# EAGLE schematic nano-esp-stm-breakout (EAGLE 9.6.2)

## Sheet 1 of 2
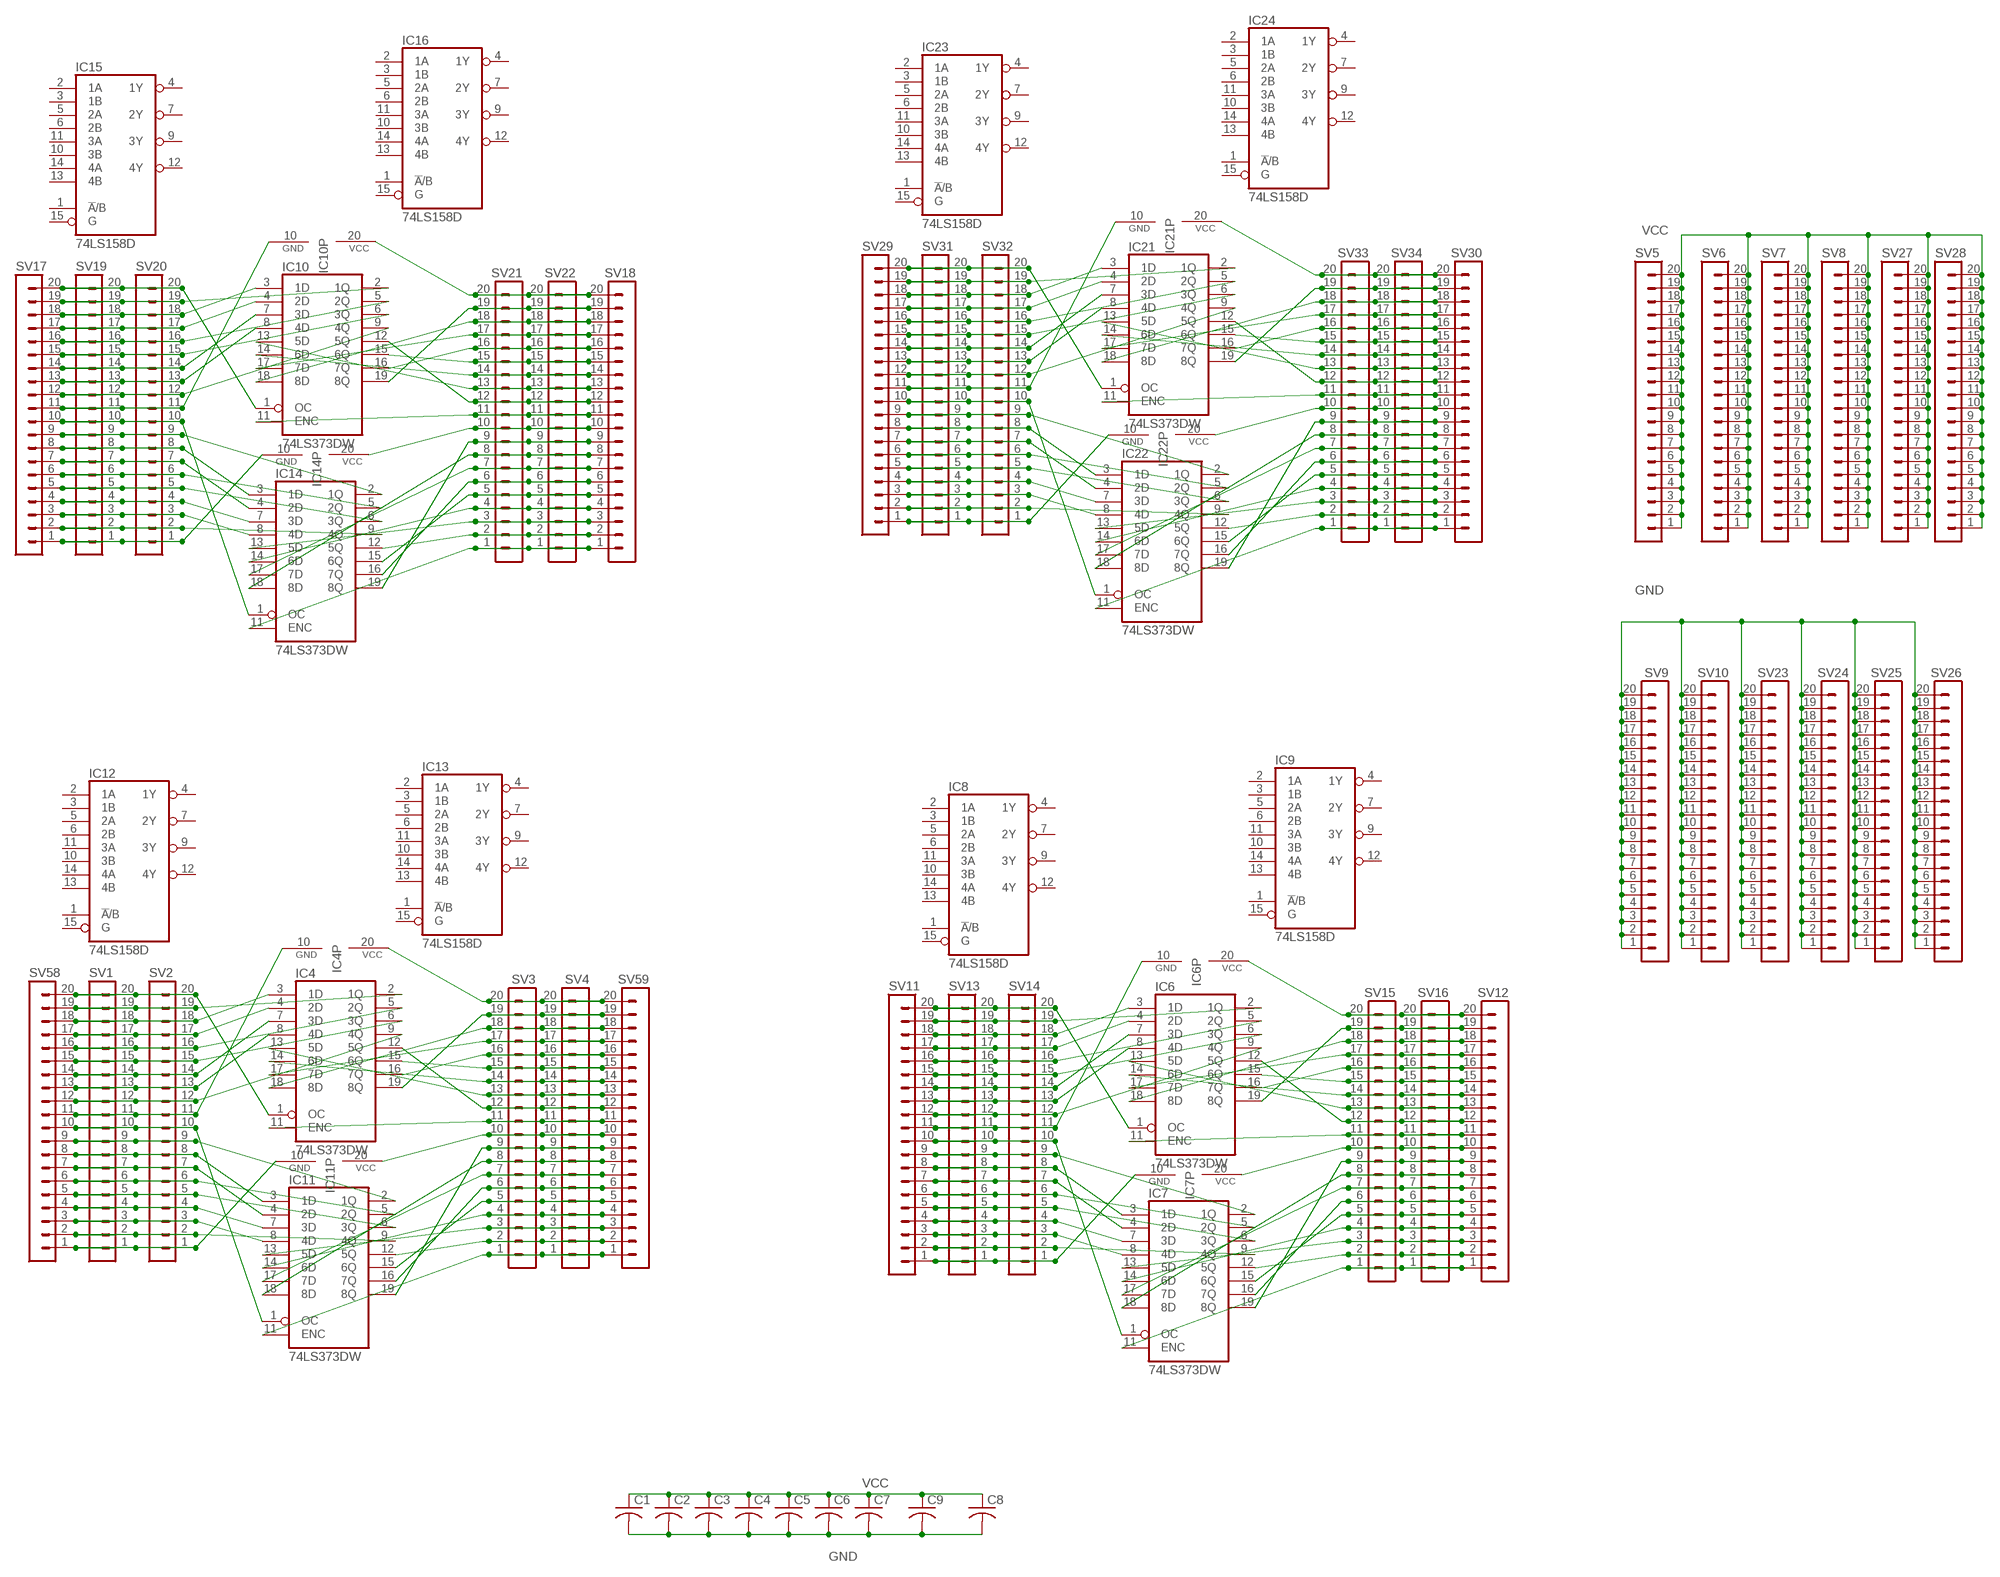
[diagram p0: schematic, sheet 1]

### Parts
C1  C-USC0805  [C0805]
C2  C-USC0805  [C0805]
C3  C-USC0805  [C0805]
C4  C-USC0805  [C0805]
C5  C-USC0805  [C0805]
C6  C-USC0805  [C0805]
C7  C-USC0805  [C0805]
C8  C-USC0805  [C0805]
C9  C-USC0805  [C0805]
IC4  74LS373DW  [SO20W]
IC6  74LS373DW  [SO20W]
IC7  74LS373DW  [SO20W]
IC8  74LS158D  [SO16]
IC9  74LS158D  [SO16]
IC10  74LS373DW  [SO20W]
IC11  74LS373DW  [SO20W]
IC12  74LS158D  [SO16]
IC13  74LS158D  [SO16]
IC14  74LS373DW  [SO20W]
IC15  74LS158D  [SO16]
IC16  74LS158D  [SO16]
IC21  74LS373DW  [SO20W]
IC22  74LS373DW  [SO20W]
IC23  74LS158D  [SO16]
IC24  74LS158D  [SO16]
SV1  MA20-1  [MA20-1]
SV2  MA20-1  [MA20-1]
SV3  MA20-1  [MA20-1]
SV4  MA20-1  [MA20-1]
SV5  MA20-1  [MA20-1]
SV6  MA20-1  [MA20-1]
SV7  MA20-1  [MA20-1]
SV8  MA20-1  [MA20-1]
SV9  MA20-1  [MA20-1]
SV10  MA20-1  [MA20-1]
SV11  MA20-1  [MA20-1]
SV12  MA20-1  [MA20-1]
SV13  MA20-1  [MA20-1]
SV14  MA20-1  [MA20-1]
SV15  MA20-1  [MA20-1]
SV16  MA20-1  [MA20-1]
SV17  MA20-1  [MA20-1]
SV18  MA20-1  [MA20-1]
SV19  MA20-1  [MA20-1]
SV20  MA20-1  [MA20-1]
SV21  MA20-1  [MA20-1]
SV22  MA20-1  [MA20-1]
SV23  MA20-1  [MA20-1]
SV24  MA20-1  [MA20-1]
SV25  MA20-1  [MA20-1]
SV26  MA20-1  [MA20-1]
SV27  MA20-1  [MA20-1]
SV28  MA20-1  [MA20-1]
SV29  MA20-1  [MA20-1]
SV30  MA20-1  [MA20-1]
SV31  MA20-1  [MA20-1]
SV32  MA20-1  [MA20-1]
SV33  MA20-1  [MA20-1]
SV34  MA20-1  [MA20-1]
SV58  MA20-1  [MA20-1]
SV59  MA20-1  [MA20-1]

### Nets
GND: C1.2 C2.2 C3.2 C4.2 C5.2 C6.2 C7.2 C8.2 C9.2 SV9.1 SV9.2 SV9.3 SV9.4 SV9.5 SV9.6 SV9.7 SV9.8 SV9.9 SV9.10 SV9.11 SV9.12 SV9.13 SV9.14 SV9.15 SV9.16 SV9.17 SV9.18 SV9.19 SV9.20 SV10.1 SV10.2 SV10.3 SV10.4 SV10.5 SV10.6 SV10.7 SV10.8 SV10.9 SV10.10 SV10.11 SV10.12 SV10.13 SV10.14 SV10.15 SV10.16 SV10.17 SV10.18 SV10.19 SV10.20 SV23.1 SV23.2 SV23.3 SV23.4 SV23.5 SV23.6 SV23.7 SV23.8 SV23.9 SV23.10 SV23.11 SV23.12 SV23.13 SV23.14 SV23.15 SV23.16 SV23.17 SV23.18 SV23.19 SV23.20 SV24.1 SV24.2 SV24.3 SV24.4 SV24.5 SV24.6 SV24.7 SV24.8 SV24.9 SV24.10 SV24.11 SV24.12 SV24.13 SV24.14 SV24.15 SV24.16 SV24.17 SV24.18 SV24.19 SV24.20 SV25.1 SV25.2 SV25.3 SV25.4 SV25.5 SV25.6 SV25.7 SV25.8 SV25.9 SV25.10 SV25.11 SV25.12 SV25.13 SV25.14 SV25.15 SV25.16 SV25.17 SV25.18 SV25.19 SV25.20 SV26.1 SV26.2 SV26.3 SV26.4 SV26.5 SV26.6 SV26.7 SV26.8 SV26.9 SV26.10 SV26.11 SV26.12 SV26.13 SV26.14 SV26.15 SV26.16 SV26.17 SV26.18 SV26.19 SV26.20 ; also sheet 2
N$41: IC7.9(4Q) SV11.2 SV13.2 SV14.2
N$42: IC7.7(3D) SV11.4 SV13.4 SV14.4
N$43: IC7.6(3Q) SV11.5 SV13.5 SV14.5
N$44: IC7.5(2Q) SV11.6 SV13.6 SV14.6
N$45: IC7.3(1D) SV11.8 SV13.8 SV14.8
N$46: IC7.2(1Q) SV11.9 SV13.9 SV14.9
N$47: IC7.1(OC) SV11.10 SV13.10 SV14.10
N$48: IC6.10(GND) SV11.11 SV13.11 SV14.11
N$49: IC6.9(4Q) SV11.12 SV13.12 SV14.12
N$50: IC6.7(3D) SV11.14 SV13.14 SV14.14
N$51: IC6.6(3Q) SV11.15 SV13.15 SV14.15
N$52: IC6.5(2Q) SV11.16 SV13.16 SV14.16
N$53: IC6.3(1D) SV11.18 SV13.18 SV14.18
N$54: IC6.2(1Q) SV11.19 SV13.19 SV14.19
N$55: IC6.1(OC) SV11.20 SV13.20 SV14.20
N$56: IC7.11(ENC) SV12.1 SV15.1 SV16.1
N$57: IC7.12(5Q) SV12.2 SV15.2 SV16.2
N$58: IC7.13(5D) SV12.3 SV15.3 SV16.3
N$59: IC7.14(6D) SV12.4 SV15.4 SV16.4
N$60: IC7.15(6Q) SV12.5 SV15.5 SV16.5
N$61: IC7.16(7Q) SV12.6 SV15.6 SV16.6
N$62: IC7.17(7D) SV12.7 SV15.7 SV16.7
N$63: IC7.18(8D) SV12.8 SV15.8 SV16.8
N$64: IC7.19(8Q) SV12.9 SV15.9 SV16.9
N$65: IC7.20(VCC) SV12.10 SV15.10 SV16.10
N$66: IC6.11(ENC) SV12.11 SV15.11 SV16.11
N$67: IC6.12(5Q) SV12.12 SV15.12 SV16.12
N$68: IC6.13(5D) SV12.13 SV15.13 SV16.13
N$69: IC6.14(6D) SV12.14 SV15.14 SV16.14
N$70: IC6.15(6Q) SV12.15 SV15.15 SV16.15
N$71: IC6.16(7Q) SV12.16 SV15.16 SV16.16
N$72: IC6.17(7D) SV12.17 SV15.17 SV16.17
N$73: IC6.18(8D) SV12.18 SV15.18 SV16.18
N$74: IC6.19(8Q) SV12.19 SV15.19 SV16.19
N$75: IC7.10(GND) SV11.1 SV13.1 SV14.1
N$76: IC7.8(4D) SV11.3 SV13.3 SV14.3
N$77: IC7.4(2D) SV11.7 SV13.7 SV14.7
N$78: IC6.8(4D) SV11.13 SV13.13 SV14.13
N$79: IC6.4(2D) SV11.17 SV13.17 SV14.17
N$80: IC6.20(VCC) SV12.20 SV15.20 SV16.20
N$81: IC14.9(4Q) SV17.2 SV19.2 SV20.2
N$82: IC14.7(3D) SV17.4 SV19.4 SV20.4
N$83: IC14.6(3Q) SV17.5 SV19.5 SV20.5
N$84: IC14.5(2Q) SV17.6 SV19.6 SV20.6
N$85: IC14.3(1D) SV17.8 SV19.8 SV20.8
N$86: IC14.2(1Q) SV17.9 SV19.9 SV20.9
N$87: IC14.1(OC) SV17.10 SV19.10 SV20.10
N$88: IC10.10(GND) SV17.11 SV19.11 SV20.11
N$89: IC10.9(4Q) SV17.12 SV19.12 SV20.12
N$90: IC10.7(3D) SV17.14 SV19.14 SV20.14
N$91: IC10.6(3Q) SV17.15 SV19.15 SV20.15
N$92: IC10.5(2Q) SV17.16 SV19.16 SV20.16
N$93: IC10.3(1D) SV17.18 SV19.18 SV20.18
N$94: IC10.2(1Q) SV17.19 SV19.19 SV20.19
N$95: IC10.1(OC) SV17.20 SV19.20 SV20.20
N$96: IC14.11(ENC) SV18.1 SV21.1 SV22.1
N$97: IC14.12(5Q) SV18.2 SV21.2 SV22.2
N$98: IC14.13(5D) SV18.3 SV21.3 SV22.3
N$99: IC14.14(6D) SV18.4 SV21.4 SV22.4
N$100: IC14.15(6Q) SV18.5 SV21.5 SV22.5
N$101: IC14.16(7Q) SV18.6 SV21.6 SV22.6
N$102: IC14.17(7D) SV18.7 SV21.7 SV22.7
N$103: IC14.18(8D) SV18.8 SV21.8 SV22.8
N$104: IC14.19(8Q) SV18.9 SV21.9 SV22.9
N$105: IC14.20(VCC) SV18.10 SV21.10 SV22.10
N$106: IC10.11(ENC) SV18.11 SV21.11 SV22.11
N$107: IC10.12(5Q) SV18.12 SV21.12 SV22.12
N$108: IC10.13(5D) SV18.13 SV21.13 SV22.13
N$109: IC10.14(6D) SV18.14 SV21.14 SV22.14
N$110: IC10.15(6Q) SV18.15 SV21.15 SV22.15
N$111: IC10.16(7Q) SV18.16 SV21.16 SV22.16
N$112: IC10.17(7D) SV18.17 SV21.17 SV22.17
N$113: IC10.18(8D) SV18.18 SV21.18 SV22.18
N$114: IC10.19(8Q) SV18.19 SV21.19 SV22.19
N$115: IC14.10(GND) SV17.1 SV19.1 SV20.1
N$116: IC14.8(4D) SV17.3 SV19.3 SV20.3
N$117: IC14.4(2D) SV17.7 SV19.7 SV20.7
N$118: IC10.8(4D) SV17.13 SV19.13 SV20.13
N$119: IC10.4(2D) SV17.17 SV19.17 SV20.17
N$120: IC10.20(VCC) SV18.20 SV21.20 SV22.20
N$161: IC22.9(4Q) SV29.2 SV31.2 SV32.2
N$162: IC22.7(3D) SV29.4 SV31.4 SV32.4
N$163: IC22.6(3Q) SV29.5 SV31.5 SV32.5
N$164: IC22.5(2Q) SV29.6 SV31.6 SV32.6
N$165: IC22.3(1D) SV29.8 SV31.8 SV32.8
N$166: IC22.2(1Q) SV29.9 SV31.9 SV32.9
N$167: IC22.1(OC) SV29.10 SV31.10 SV32.10
N$168: IC21.10(GND) SV29.11 SV31.11 SV32.11
N$169: IC21.9(4Q) SV29.12 SV31.12 SV32.12
N$170: IC21.7(3D) SV29.14 SV31.14 SV32.14
N$171: IC21.6(3Q) SV29.15 SV31.15 SV32.15
N$172: IC21.5(2Q) SV29.16 SV31.16 SV32.16
N$173: IC21.3(1D) SV29.18 SV31.18 SV32.18
N$174: IC21.2(1Q) SV29.19 SV31.19 SV32.19
N$175: IC21.1(OC) SV29.20 SV31.20 SV32.20
N$176: IC22.11(ENC) SV30.1 SV33.1 SV34.1
N$177: IC22.12(5Q) SV30.2 SV33.2 SV34.2
N$178: IC22.13(5D) SV30.3 SV33.3 SV34.3
N$179: IC22.14(6D) SV30.4 SV33.4 SV34.4
N$180: IC22.15(6Q) SV30.5 SV33.5 SV34.5
N$181: IC22.16(7Q) SV30.6 SV33.6 SV34.6
N$182: IC22.17(7D) SV30.7 SV33.7 SV34.7
N$183: IC22.18(8D) SV30.8 SV33.8 SV34.8
N$184: IC22.19(8Q) SV30.9 SV33.9 SV34.9
N$185: IC22.20(VCC) SV30.10 SV33.10 SV34.10
N$186: IC21.11(ENC) SV30.11 SV33.11 SV34.11
N$187: IC21.12(5Q) SV30.12 SV33.12 SV34.12
N$188: IC21.13(5D) SV30.13 SV33.13 SV34.13
N$189: IC21.14(6D) SV30.14 SV33.14 SV34.14
N$190: IC21.15(6Q) SV30.15 SV33.15 SV34.15
N$191: IC21.16(7Q) SV30.16 SV33.16 SV34.16
N$192: IC21.17(7D) SV30.17 SV33.17 SV34.17
N$193: IC21.18(8D) SV30.18 SV33.18 SV34.18
N$194: IC21.19(8Q) SV30.19 SV33.19 SV34.19
N$195: IC22.10(GND) SV29.1 SV31.1 SV32.1
N$196: IC22.8(4D) SV29.3 SV31.3 SV32.3
N$197: IC22.4(2D) SV29.7 SV31.7 SV32.7
N$198: IC21.8(4D) SV29.13 SV31.13 SV32.13
N$199: IC21.4(2D) SV29.17 SV31.17 SV32.17
N$200: IC21.20(VCC) SV30.20 SV33.20 SV34.20
N$239: IC11.9(4Q) SV1.2 SV2.2 SV58.2
N$241: IC11.7(3D) SV1.4 SV2.4 SV58.4
N$242: IC11.6(3Q) SV1.5 SV2.5 SV58.5
N$243: IC11.5(2Q) SV1.6 SV2.6 SV58.6
N$245: IC11.3(1D) SV1.8 SV2.8 SV58.8
N$246: IC11.2(1Q) SV1.9 SV2.9 SV58.9
N$247: IC11.1(OC) SV1.10 SV2.10 SV58.10
N$248: IC4.10(GND) SV1.11 SV2.11 SV58.11
N$249: IC4.9(4Q) SV1.12 SV2.12 SV58.12
N$251: IC4.7(3D) SV1.14 SV2.14 SV58.14
N$252: IC4.6(3Q) SV1.15 SV2.15 SV58.15
N$253: IC4.5(2Q) SV1.16 SV2.16 SV58.16
N$255: IC4.3(1D) SV1.18 SV2.18 SV58.18
N$256: IC4.2(1Q) SV1.19 SV2.19 SV58.19
N$257: IC4.1(OC) SV1.20 SV2.20 SV58.20
N$258: IC11.11(ENC) SV3.1 SV4.1 SV59.1
N$259: IC11.12(5Q) SV3.2 SV4.2 SV59.2
N$260: IC11.13(5D) SV3.3 SV4.3 SV59.3
N$261: IC11.14(6D) SV3.4 SV4.4 SV59.4
N$262: IC11.15(6Q) SV3.5 SV4.5 SV59.5
N$263: IC11.16(7Q) SV3.6 SV4.6 SV59.6
N$264: IC11.17(7D) SV3.7 SV4.7 SV59.7
N$265: IC11.18(8D) SV3.8 SV4.8 SV59.8
N$266: IC11.19(8Q) SV3.9 SV4.9 SV59.9
N$267: IC11.20(VCC) SV3.10 SV4.10 SV59.10
N$268: IC4.11(ENC) SV3.11 SV4.11 SV59.11
N$269: IC4.12(5Q) SV3.12 SV4.12 SV59.12
N$270: IC4.13(5D) SV3.13 SV4.13 SV59.13
N$271: IC4.14(6D) SV3.14 SV4.14 SV59.14
N$272: IC4.15(6Q) SV3.15 SV4.15 SV59.15
N$273: IC4.16(7Q) SV3.16 SV4.16 SV59.16
N$274: IC4.17(7D) SV3.17 SV4.17 SV59.17
N$275: IC4.18(8D) SV3.18 SV4.18 SV59.18
N$276: IC4.19(8Q) SV3.19 SV4.19 SV59.19
N$278: IC11.10(GND) SV1.1 SV2.1 SV58.1
N$279: IC11.8(4D) SV1.3 SV2.3 SV58.3
N$281: IC11.4(2D) SV1.7 SV2.7 SV58.7
N$284: IC4.8(4D) SV1.13 SV2.13 SV58.13
N$286: IC4.4(2D) SV1.17 SV2.17 SV58.17
N$319: IC4.20(VCC) SV3.20 SV4.20 SV59.20
VCC: C1.1 C2.1 C3.1 C4.1 C5.1 C6.1 C7.1 C8.1 C9.1 SV5.1 SV5.2 SV5.3 SV5.4 SV5.5 SV5.6 SV5.7 SV5.8 SV5.9 SV5.10 SV5.11 SV5.12 SV5.13 SV5.14 SV5.15 SV5.16 SV5.17 SV5.18 SV5.19 SV5.20 SV6.1 SV6.2 SV6.3 SV6.4 SV6.5 SV6.6 SV6.7 SV6.8 SV6.9 SV6.10 SV6.11 SV6.12 SV6.13 SV6.14 SV6.15 SV6.16 SV6.17 SV6.18 SV6.19 SV6.20 SV7.1 SV7.2 SV7.3 SV7.4 SV7.5 SV7.6 SV7.7 SV7.8 SV7.9 SV7.10 SV7.11 SV7.12 SV7.13 SV7.14 SV7.15 SV7.16 SV7.17 SV7.18 SV7.19 SV7.20 SV8.1 SV8.2 SV8.3 SV8.4 SV8.5 SV8.6 SV8.7 SV8.8 SV8.9 SV8.10 SV8.11 SV8.12 SV8.13 SV8.14 SV8.15 SV8.16 SV8.17 SV8.18 SV8.19 SV8.20 SV27.1 SV27.2 SV27.3 SV27.4 SV27.5 SV27.6 SV27.7 SV27.8 SV27.9 SV27.10 SV27.11 SV27.12 SV27.13 SV27.14 SV27.15 SV27.16 SV27.17 SV27.18 SV27.19 SV27.20 SV28.1 SV28.2 SV28.3 SV28.4 SV28.5 SV28.6 SV28.7 SV28.8 SV28.9 SV28.10 SV28.11 SV28.12 SV28.13 SV28.14 SV28.15 SV28.16 SV28.17 SV28.18 SV28.19 SV28.20 ; also sheet 2
Unconnected: IC8.1(!A!/B) IC8.2(1A) IC8.3(1B) IC8.4(1Y) IC8.5(2A) IC8.6(2B) IC8.7(2Y) IC8.9(3Y) IC8.10(3B) IC8.11(3A) IC8.12(4Y) IC8.13(4B) IC8.14(4A) IC8.15(G) IC9.1(!A!/B) IC9.2(1A) IC9.3(1B) IC9.4(1Y) IC9.5(2A) IC9.6(2B) IC9.7(2Y) IC9.9(3Y) IC9.10(3B) IC9.11(3A) IC9.12(4Y) IC9.13(4B) IC9.14(4A) IC9.15(G) IC12.1(!A!/B) IC12.2(1A) IC12.3(1B) IC12.4(1Y) IC12.5(2A) IC12.6(2B) IC12.7(2Y) IC12.9(3Y) IC12.10(3B) IC12.11(3A) IC12.12(4Y) IC12.13(4B) IC12.14(4A) IC12.15(G) IC13.1(!A!/B) IC13.2(1A) IC13.3(1B) IC13.4(1Y) IC13.5(2A) IC13.6(2B) IC13.7(2Y) IC13.9(3Y) IC13.10(3B) IC13.11(3A) IC13.12(4Y) IC13.13(4B) IC13.14(4A) IC13.15(G) IC15.1(!A!/B) IC15.2(1A) IC15.3(1B) IC15.4(1Y) IC15.5(2A) IC15.6(2B) IC15.7(2Y) IC15.9(3Y) IC15.10(3B) IC15.11(3A) IC15.12(4Y) IC15.13(4B) IC15.14(4A) IC15.15(G) IC16.1(!A!/B) IC16.2(1A) IC16.3(1B) IC16.4(1Y) IC16.5(2A) IC16.6(2B) IC16.7(2Y) IC16.9(3Y) IC16.10(3B) IC16.11(3A) IC16.12(4Y) IC16.13(4B) IC16.14(4A) IC16.15(G) IC23.1(!A!/B) IC23.2(1A) IC23.3(1B) IC23.4(1Y) IC23.5(2A) IC23.6(2B) IC23.7(2Y) IC23.9(3Y) IC23.10(3B) IC23.11(3A) IC23.12(4Y) IC23.13(4B) IC23.14(4A) IC23.15(G) IC24.1(!A!/B) IC24.2(1A) IC24.3(1B) IC24.4(1Y) IC24.5(2A) IC24.6(2B) IC24.7(2Y) IC24.9(3Y) IC24.10(3B) IC24.11(3A) IC24.12(4Y) IC24.13(4B) IC24.14(4A) IC24.15(G)

## Sheet 2 of 2
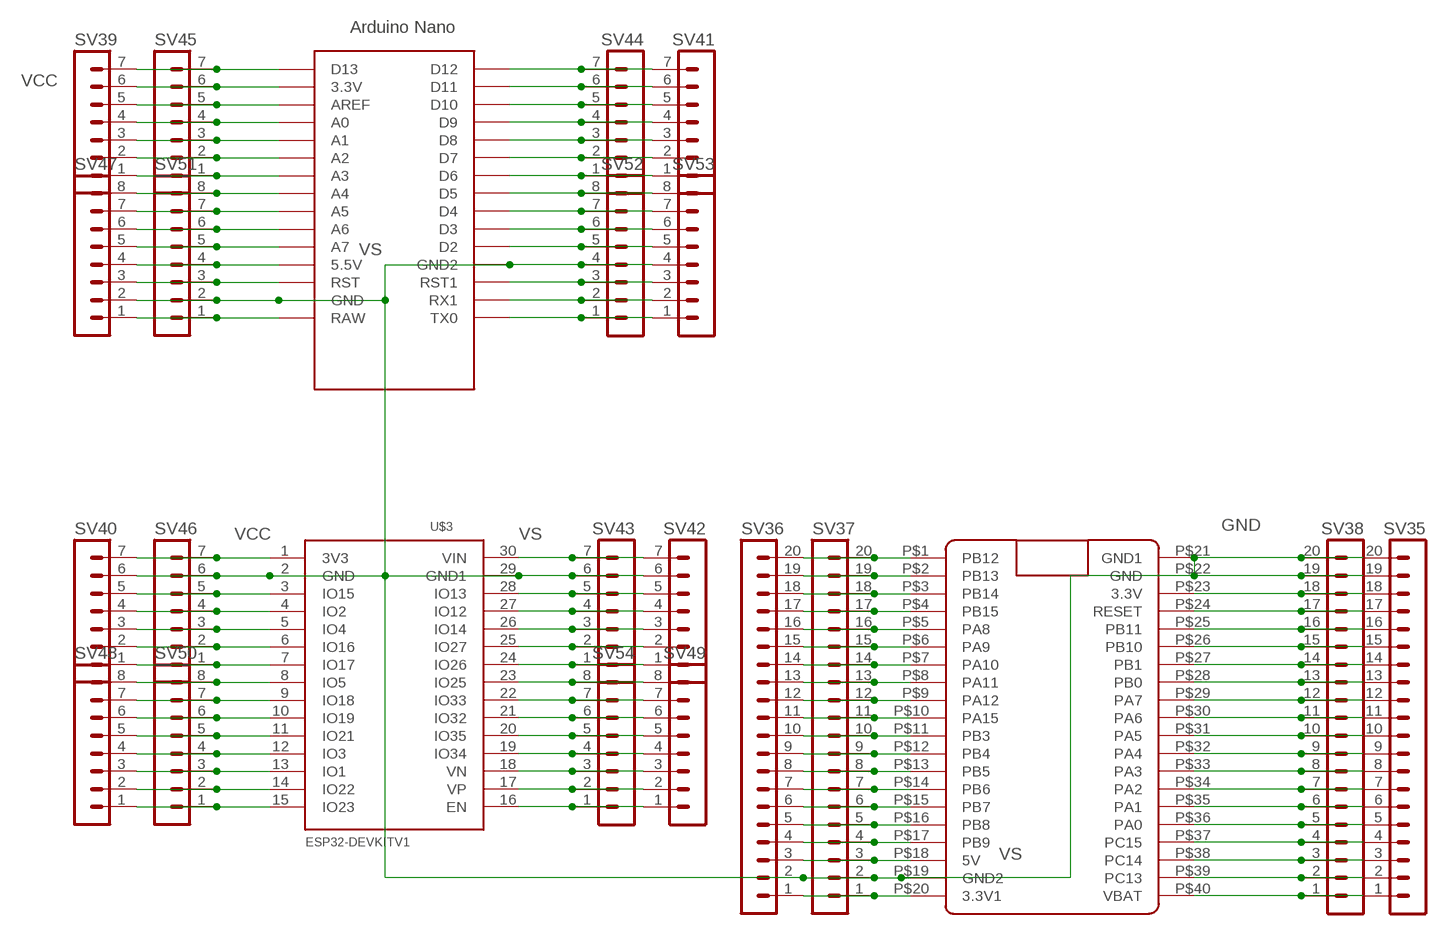
[diagram p1: schematic, sheet 2]

### Parts
SV35  MA20-1  [MA20-1]
SV36  MA20-1  [MA20-1]
SV37  MA20-1  [MA20-1]
SV38  MA20-1  [MA20-1]
SV39  MA07-1  [MA07-1]
SV40  MA07-1  [MA07-1]
SV41  MA07-1  [MA07-1]
SV42  MA07-1  [MA07-1]
SV43  MA07-1  [MA07-1]
SV44  MA07-1  [MA07-1]
SV45  MA07-1  [MA07-1]
SV46  MA07-1  [MA07-1]
SV47  MA08-1  [MA08-1]
SV48  MA08-1  [MA08-1]
SV49  MA08-1  [MA08-1]
SV50  MA08-1  [MA08-1]
SV51  MA08-1  [MA08-1]
SV52  MA08-1  [MA08-1]
SV53  MA08-1  [MA08-1]
SV54  MA08-1  [MA08-1]
U$1  NANO  [NANO]
U$2  BLUE_PILL  [BLUE_PILL]
U$3  ESP32DEVKITV1  [ESP32-DEVKITV1]

### Nets
GND: SV35.19 SV35.20 SV36.2 SV37.2 SV38.19 SV38.20 SV40.6 SV42.6 SV43.6 SV46.6 SV47.2 SV51.2 SV52.4 SV53.4 U$1.GND U$1.GND1(GND2) U$2.P$19(GND2) U$2.P$21(GND1) U$2.P$22(GND) U$3.2(GND) U$3.29(GND1) ; also sheet 1
N$1: SV39.1 SV45.1 U$1.A3
N$2: SV39.2 SV45.2 U$1.A2
N$3: SV35.18 SV38.18 U$2.P$23(3.3V)
N$4: SV35.17 SV38.17 U$2.P$24(RESET)
N$5: SV35.16 SV38.16 U$2.P$25(PB11)
N$6: SV35.15 SV38.15 U$2.P$26(PB10)
N$7: SV35.14 SV38.14 U$2.P$27(PB1)
N$8: SV35.13 SV38.13 U$2.P$28(PB0)
N$9: SV35.12 SV38.12 U$2.P$29(PA7)
N$10: SV35.11 SV38.11 U$2.P$30(PA6)
N$11: SV35.10 SV38.10 U$2.P$31(PA5)
N$12: SV35.9 SV38.9 U$2.P$32(PA4)
N$13: SV35.8 SV38.8 U$2.P$33(PA3)
N$14: SV35.7 SV38.7 U$2.P$34(PA2)
N$15: SV35.6 SV38.6 U$2.P$35(PA1)
N$16: SV35.5 SV38.5 U$2.P$36(PA0)
N$17: SV35.4 SV38.4 U$2.P$37(PC15)
N$18: SV35.3 SV38.3 U$2.P$38(PC14)
N$19: SV35.2 SV38.2 U$2.P$39(PC13)
N$20: SV35.1 SV38.1 U$2.P$40(VBAT)
N$21: SV36.1 SV37.1 U$2.P$20(3.3V1)
N$22: SV39.3 SV45.3 U$1.A1
N$24: SV36.4 SV37.4 U$2.P$17(PB9)
N$25: SV36.5 SV37.5 U$2.P$16(PB8)
N$26: SV36.6 SV37.6 U$2.P$15(PB7)
N$27: SV36.7 SV37.7 U$2.P$14(PB6)
N$28: SV36.8 SV37.8 U$2.P$13(PB5)
N$29: SV36.9 SV37.9 U$2.P$12(PB4)
N$30: SV36.10 SV37.10 U$2.P$11(PB3)
N$31: SV36.11 SV37.11 U$2.P$10(PA15)
N$32: SV36.12 SV37.12 U$2.P$9(PA12)
N$33: SV36.13 SV37.13 U$2.P$8(PA11)
N$34: SV36.14 SV37.14 U$2.P$7(PA10)
N$35: SV36.15 SV37.15 U$2.P$6(PA9)
N$36: SV36.16 SV37.16 U$2.P$5(PA8)
N$37: SV36.17 SV37.17 U$2.P$4(PB15)
N$38: SV36.18 SV37.18 U$2.P$3(PB14)
N$39: SV36.19 SV37.19 U$2.P$2(PB13)
N$40: SV36.20 SV37.20 U$2.P$1(PB12)
N$121: SV39.4 SV45.4 U$1.A0
N$122: SV39.5 SV45.5 U$1.AREF
N$124: SV39.7 SV45.7 U$1.D13
N$125: SV40.1 SV46.1 U$3.7(IO17)
N$126: SV40.2 SV46.2 U$3.6(IO16)
N$127: SV40.3 SV46.3 U$3.5(IO4)
N$128: SV40.4 SV46.4 U$3.4(IO2)
N$129: SV40.5 SV46.5 U$3.3(IO15)
N$132: SV41.1 SV44.1 U$1.D6
N$133: SV41.2 SV44.2 U$1.D7
N$134: SV41.3 SV44.3 U$1.D8
N$135: SV41.4 SV44.4 U$1.D9
N$136: SV41.5 SV44.5 U$1.D10
N$137: SV41.6 SV44.6 U$1.D11
N$138: SV41.7 SV44.7 U$1.D12
N$139: SV42.1 SV43.1 U$3.24(IO26)
N$140: SV42.2 SV43.2 U$3.25(IO27)
N$141: SV42.3 SV43.3 U$3.26(IO14)
N$142: SV42.4 SV43.4 U$3.27(IO12)
N$143: SV42.5 SV43.5 U$3.28(IO13)
N$146: SV47.1 SV51.1 U$1.RAW
N$148: SV47.3 SV51.3 U$1.RST
N$150: SV47.5 SV51.5 U$1.A7
N$151: SV47.6 SV51.6 U$1.A6
N$152: SV47.7 SV51.7 U$1.A5
N$153: SV47.8 SV51.8 U$1.A4
N$154: SV49.1 SV54.1 U$3.16(EN)
N$155: SV49.2 SV54.2 U$3.17(VP)
N$156: SV49.3 SV54.3 U$3.18(VN)
N$157: SV49.4 SV54.4 U$3.19(IO34)
N$158: SV49.5 SV54.5 U$3.20(IO35)
N$159: SV49.6 SV54.6 U$3.21(IO32)
N$160: SV49.7 SV54.7 U$3.22(IO33)
N$201: SV49.8 SV54.8 U$3.23(IO25)
N$202: SV52.1 SV53.1 U$1.TX0
N$203: SV52.2 SV53.2 U$1.RX1
N$204: SV52.3 SV53.3 U$1.RST1
N$206: SV52.5 SV53.5 U$1.D2
N$207: SV52.6 SV53.6 U$1.D3
N$208: SV52.7 SV53.7 U$1.D4
N$209: SV52.8 SV53.8 U$1.D5
N$210: SV48.1 SV50.1 U$3.15(IO23)
N$211: SV48.2 SV50.2 U$3.14(IO22)
N$212: SV48.3 SV50.3 U$3.13(IO1)
N$213: SV48.4 SV50.4 U$3.12(IO3)
N$214: SV48.5 SV50.5 U$3.11(IO21)
N$215: SV48.6 SV50.6 U$3.10(IO19)
N$216: SV48.7 SV50.7 U$3.9(IO18)
N$217: SV48.8 SV50.8 U$3.8(IO5)
VCC: SV39.6 SV40.7 SV45.6 SV46.7 U$1.3.3V U$3.1(3V3) ; also sheet 1
VS: SV36.3 SV37.3 SV42.7 SV43.7 SV47.4 SV51.4 U$1.5V(5.5V) U$2.P$18(5V) U$3.30(VIN)
Unconnected: U$1.ICSP1 U$1.ICSP2 U$1.ICSP3 U$1.ICSP4 U$1.ICSP5 U$1.ICSP6

## Power pins joined to a net without a drawn wire
GND: IC8.8(GND) IC9.8(GND) IC12.8(GND) IC13.8(GND) IC15.8(GND) IC16.8(GND) IC23.8(GND) IC24.8(GND)
VCC: IC8.16(VCC) IC9.16(VCC) IC12.16(VCC) IC13.16(VCC) IC15.16(VCC) IC16.16(VCC) IC23.16(VCC) IC24.16(VCC)

## Library data of the parts
C1-C9 = rcl:C-US: CAPACITOR, American symbol; SPICEPREFIX: C
IC4 IC6 IC7 IC10 IC11 IC14 IC21 IC22 = 74xx-us:74*373: Octal D type transparent LATCH, edge triggered
IC8 IC9 IC12 IC13 IC15 IC16 IC23 IC24 = 74xx-us:74*158: Quadruple 2-line to 1-line data SELECTOR/MULTIPLEXER
SV1-SV38 SV58 SV59 = con-lstb:MA20-1: PIN HEADER; OC_FARNELL: unknown; OC_NEWARK: unknown
SV39-SV46 = con-lstb:MA07-1: PIN HEADER; OC_FARNELL: unknown; OC_NEWARK: unknown
SV47-SV54 = con-lstb:MA08-1: PIN HEADER; OC_FARNELL: unknown; OC_NEWARK: unknown
U$1 = Arduino-clone:NANO: Arduino Nano
U$2 = BluePill:BLUE_PILL
U$3 = ESP32-DEVKITV1:ESP32DEVKITV1